# Altium schematic sheet PERIPHERAL.SchDoc
size A4; SheetNumber: 4; SheetTotal: 5
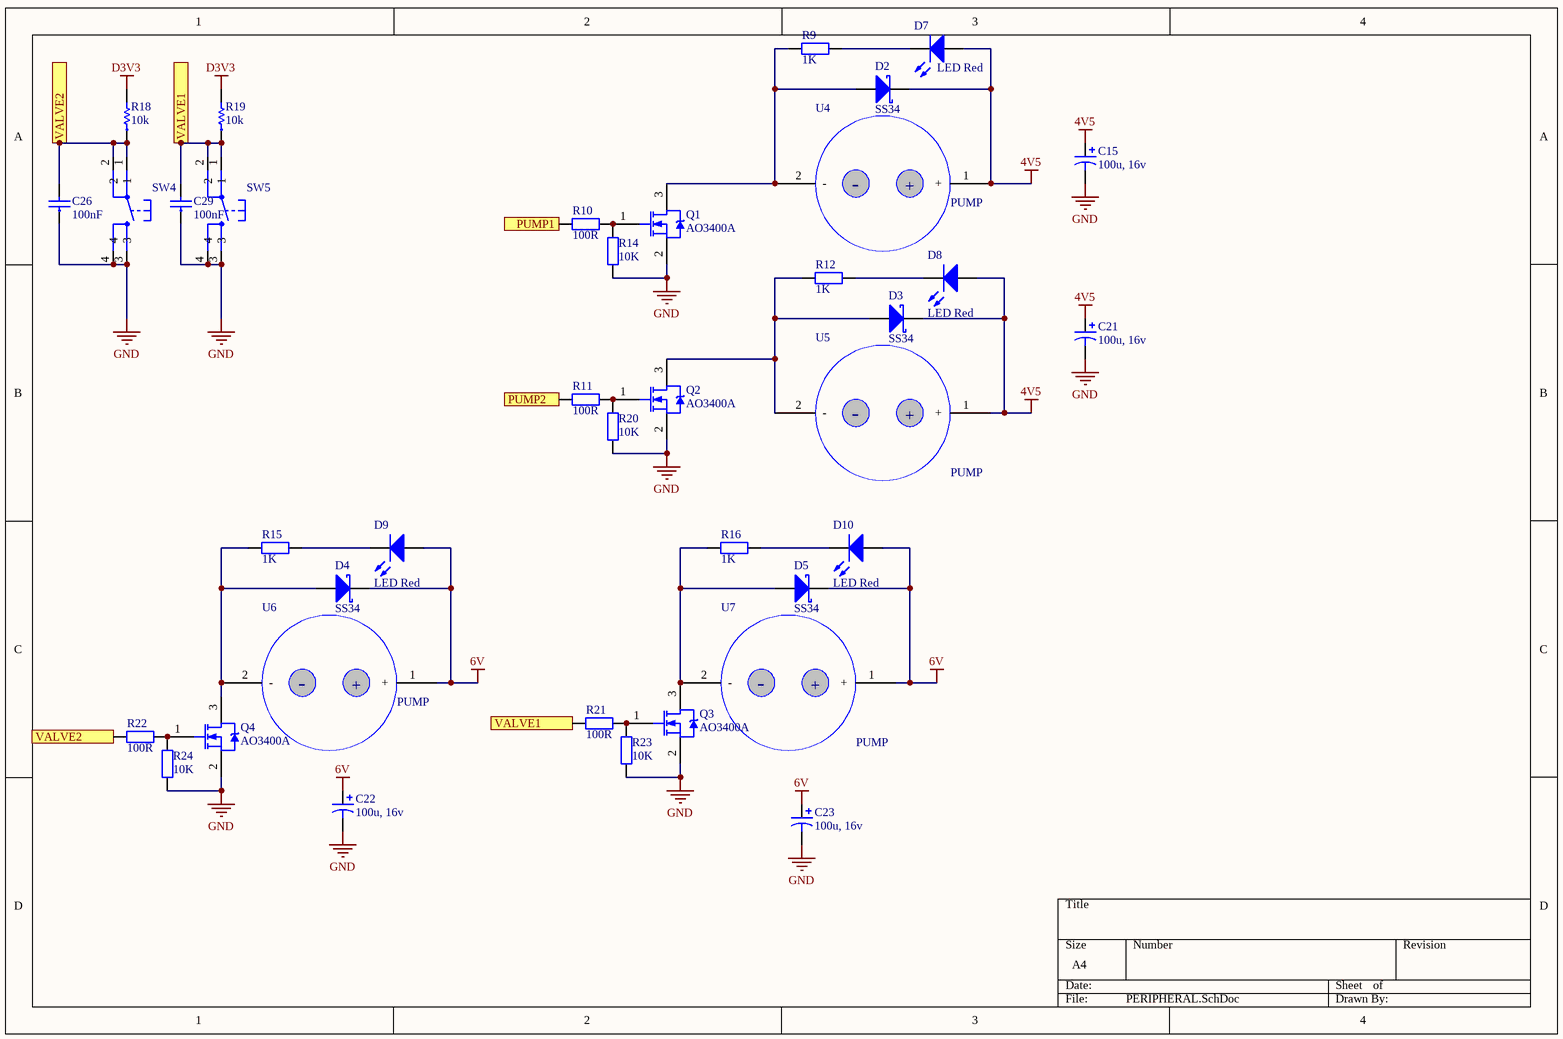
[diagram p0: PERIPHERAL.SchDoc]

## Parts
C15  value 100u, 16v  [CAPACITOR SIZE_D(D6.6)]  (hidden comment: CAP ALUM 100UF 20% 16V SMD)
C21  value 100u, 16v  [CAPACITOR SIZE_D(D6.6)]  (hidden comment: CAP ALUM 100UF 20% 16V SMD)
C22  value 100u, 16v  [CAPACITOR SIZE_D(D6.6)]  (hidden comment: CAP ALUM 100UF 20% 16V SMD)
C23  value 100u, 16v  [CAPACITOR SIZE_D(D6.6)]  (hidden comment: CAP ALUM 100UF 20% 16V SMD)
C26  100nF  [C0603]
C29  100nF  [C0603]
D2  SS34  [DO-214AC]
D3  SS34  [DO-214AC]
D4  SS34  [DO-214AC]
D5  SS34  [DO-214AC]
D7  LED Red  [LED0603-R]
D8  LED Red  [LED0603-R]
D9  LED Red  [LED0603-R]
D10  LED Red  [LED0603-R]
Q1  AO3400A  [SOT-23]
Q2  AO3400A  [SOT-23]
Q3  AO3400A  [SOT-23]
Q4  AO3400A  [SOT-23]
R9  value 1K  [R0603]  (hidden comment: RES 1K 5% 1/10W 0603)
R10  value 100R  [R0603]  (hidden comment: RES 100R 5% 1/10W 0603)
R11  value 100R  [R0603]  (hidden comment: RES 100R 5% 1/10W 0603)
R12  value 1K  [R0603]  (hidden comment: RES 1K 5% 1/10W 0603)
R14  value 10K  [R0603]  (hidden comment: RES 10K 5% 1/10W 0603)
R15  value 1K  [R0603]  (hidden comment: RES 1K 5% 1/10W 0603)
R16  value 1K  [R0603]  (hidden comment: RES 1K 5% 1/10W 0603)
R18  10k  [R0603]
R19  10k  [R0603]
R20  value 10K  [R0603]  (hidden comment: RES 10K 5% 1/10W 0603)
R21  value 100R  [R0603]  (hidden comment: RES 100R 5% 1/10W 0603)
R22  value 100R  [R0603]  (hidden comment: RES 100R 5% 1/10W 0603)
R23  value 10K  [R0603]  (hidden comment: RES 10K 5% 1/10W 0603)
R24  value 10K  [R0603]  (hidden comment: RES 10K 5% 1/10W 0603)
SW4  SW2  [SWITCH]  (value not drawn)
SW5  SW2  [SWITCH]  (value not drawn)
U4  PUMP  [Pump]
U5  PUMP  [Pump]
U6  PUMP  [VALVE]
U7  PUMP  [VALVE]

## Ports
PUMP1 (in), PUMP2 (in), VALVE1 (in), VALVE2 (in)

## Nets
4V5: C15.1 C21.1 D2.2(K) D3.2(K) D7.1(A) D8.1(A) U4.1(+) U5.1(+)
6V: C22.1 C23.1 D4.2(K) D5.2(K) D9.1(A) D10.1(A) U6.1(+) U7.1(+)
D3V3: R18.2 R19.2
GND: C15.2 C21.2 C22.2 C23.2 C26.1 C29.1 Q1.2(S) Q2.2(S) Q3.2(S) Q4.2(S) R14.1 R20.1 R23.1 R24.1 SW4.3 SW4.4 SW5.3 SW5.4
PUMP1: R10.1 ; port PUMP1
PUMP2: R11.1 ; port PUMP2
VALVE1: C29.2 R19.1 R21.1 SW5.1 SW5.2 ; port VALVE1
VALVE2: C26.2 R18.1 R22.1 SW4.1 SW4.2 ; port VALVE2
NetD2_1: D2.1(A) Q1.3(D) R9.1 U4.2(-)
NetD3_1: D3.1(A) Q2.3(D) R12.1 U5.2(-)
NetD4_1: D4.1(A) Q4.3(D) R15.1 U6.2(-)
NetD5_1: D5.1(A) Q3.3(D) R16.1 U7.2(-)
NetD7_2: D7.2(K) R9.2
NetD8_2: D8.2(K) R12.2
NetD9_2: D9.2(K) R15.2
NetD10_2: D10.2(K) R16.2
NetQ1_1: Q1.1(G) R10.2 R14.2
NetQ2_1: Q2.1(G) R11.2 R20.2
NetQ3_1: Q3.1(G) R21.2 R23.2
NetQ4_1: Q4.1(G) R22.2 R24.2

## Library data of the parts
C15 C21-C23 = UWT1C101MCL1GB: Supplier 1: Digi-Key; Supplier Part Number 1: 493-2177-2-ND
C26 C29 = CAPCER0001 100nF 10% 50V X7R 0603 SMD: CAP CER 100nF 10% 50V X7R 0603 SMD; LINE: SMT; TYPE: EP; UNIT: PCS; TMG CODE: None; CERTIFICATION: NA; CLASS: B; MOUNT: SMD; TMG PN: CAPCER0001; ComponentLink1Description: Datasheet; ComponentLink1URL: https://datasheet.lcsc.com/lcsc/1811021431_Samsung-Electro-Mechanics-CL10B104KB8NNNC_C1591.pdf; Footprint: 0603
D2-D5 = SS34: Schottky Diode 40V 3A SMA; Supplier 1: Digi-Key; Supplier Part Number 1: SS34-E3/57TGICT-ND; Value: SS34
D7-D10 = LTST-C190KRKT: Lite-On LED Red 0603; Supplier Part Number 1: 160-1436-1-ND; Supplier 1: Digi-Key; Supplier Part Number 2: FL1413; Value: LED Red
Q1-Q4 = IRFML8244TRPBF: MOSFET N-CH 25V 5.8A SOT23; Supplier 1: Digi-Key; Supplier Part Number 1: IRFML8244TRPBFCT-ND; Value: AO3400A
R9 R12 R15 R16 = RC0603JR-071KL: Yageo RES 1K 5% 1/10W 0603; Supplier 1: LCSC; Supplier Part Number 1: C131707
R10 R11 R21 R22 = RC0603JR-07100RL: Yageo RES 100R 5% 1/10W 0603; Supplier 1: Digi-Key; Supplier Part Number 1: 311-100GRCT-ND; Supplier Part Number 2: FL2438
R14 R20 R23 R24 = RC0603JR-0710KL: Yageo RES 10K 5% 1/10W 0603; Supplier 1: Digi-Key; Supplier Part Number 1: 311-10KGRCT-ND; Supplier Part Number 2: FL2403
R18 R19 = RESCHP0428 8K4 1% 0603 SMD: RES CHP 8K4 1% 1/10W 0603 SMD; LINE: SMT; UNIT: PCS; TMG CODE: None; CERTIFICATION: NA; CLASS: B; MOUNT: SMD; TYPE: EP; ComponentLink1Description: Datasheet; ComponentLink1URL: https://datasheet.lcsc.com/lcsc/2304140030_YAGEO-RT0603FRD07100RL_C160603.pdf
SW4 SW5 = SW2: Switch button 4 pin
U4-U7 = A5F083: Connector Header 2 Position 6.35mm Solder Straight Thru-Hole 2 Terminal 1 Port MLX-Series; Manufacturer: Molex; Manufacturer Lifecycle Status: ACTIVE; Connector Type: Power; Contact Resistance: 3.5mΩ; Current Rating: 13.5A; Dielectric Material: Polyester; Gender: Female; Glow Wire Compliant: Non-compliant; Insulation Resistance: 1GΩ; Number of Circuits: 2; Operating Force: 6.672N; Plating: Tin; Plating Thickness: 3.5052µm; Voltage Rating: 600V; Supplier 1: Arrow Electronics; Manufacturer Part Number: 10-84-4022; RoHS: Compliant; Category: Headers and Wire Housings; Stock 1: 4724; Pricing 1: 1=0,2907, 10=0,267, 100=0,245, 500=0,229, 1836=0,216 (USD); China RoHS: Compliant; Color: Natural; Contact Gender: Female; Contact Material: Bronze; Contact Plating: Tin; Country of Origin: US; Flammability Rating: UL94 V-2; Halogen Free: Low Halogen; Housing Material: Nylon; Lead Free: Lead Free; Lifecycle Status: Production; Max Operating Temperature: 105°C; Min Operating Temperature: -55°C; Mount: Through Hole; Number of Contacts: 2; Number of Pins: 2; Number of Positions: 2; Number of Rows: 1; Orientation: Vertical; Packaging: Carton; Pitch: 6.35mm; Radiation Hardening: No; REACH SVHC: Yes; Schedule B: 8536694040, 8536694040|8536694040|8536694040|8536694040|8536694040; Shell Material: POLYAMIDE66; Terminal Pitch: 6.35mm; Termination: Solder; ComponentLink1URL: https://datasheet.octopart.com:443/10-84-4022-Molex-datasheet-137053637.pdf?src-supplier=element14+APAC; ComponentLink1Description: https://datasheet.octopart.com:443/10-84-4022-Molex-datasheet-137053637.pdf?src-supplier=element14+APAC; ComponentLink2URL: https://datasheet.octopart.com:443/10-84-4022-Molex-datasheet-13791970.pdf?src-supplier=Molex; ComponentLink2Description: https://datasheet.octopart.com:443/10-84-4022-Molex-datasheet-13791970.pdf?src-supplier=Molex; ComponentLink3URL: https://sigma.octopart.com:443/16272272/technical_drawing/Molex-10-84-4022.pdf?src-supplier=Molex; ComponentLink3Description: https://sigma.octopart.com:443/16272272/technical_drawing/Molex-10-84-4022.pdf?src-supplier=Molex; ComponentLink4URL: https://datasheet.octopart.com:443/010844022-Molex-datasheet-5390850.pdf?src-supplier=Molex; ComponentLink4Description: https://datasheet.octopart.com:443/010844022-Molex-datasheet-5390850.pdf?src-supplier=Molex; ComponentLink5URL: https://datasheet.octopart.com:443/10-84-4022-Molex-datasheet-154742841.pdf?src-supplier=Master+Electronics; ComponentLink5Description: https://datasheet.octopart.com:443/10-84-4022-Molex-datasheet-154742841.pdf?src-supplier=Master+Electronics; ComponentLink6URL: https://datasheet.octopart.com:443/10-84-4022-Molex-datasheet-33343972.pdf?src-supplier=Electro+Sonic; ComponentLink6Description: https://datasheet.octopart.com:443/10-84-4022-Molex-datasheet-33343972.pdf?src-supplier=Electro+Sonic; ComponentLink7URL: https://datasheet.octopart.com:443/10-84-4022-Molex-datasheet-21205596.pdf?src-supplier=Electro+Sonic; ComponentLink7Description: https://datasheet.octopart.com:443/10-84-4022-Molex-datasheet-21205596.pdf?src-supplier=Electro+Sonic; ComponentLink8URL: https://datasheet.octopart.com:443/10-84-4022-Molex-datasheet-62102692.pdf?src-supplier=Electro+Sonic; ComponentLink8Description: https://datasheet.octopart.com:443/10-84-4022-Molex-datasheet-62102692.pdf?src-supplier=Electro+Sonic; ComponentLink9URL: https://datasheet.octopart.com:443/10-84-4022-Molex-datasheet-140174504.pdf?src-supplier=RS+(Formerly+Allied+Electronics); ComponentLink9Description: https://datasheet.octopart.com:443/10-84-4022-Molex-datasheet-140174504.pdf?src-supplier=RS+(Formerly+Allied+Electronics); ComponentLink10URL: https://datasheet.octopart.com:443/10-84-4022-Molex-datasheet-120134962.pdf?src-supplier=RS+(Formerly+Allied+Electronics); ComponentLink10Description: https://datasheet.octopart.com:443/10-84-4022-Molex-datasheet-120134962.pdf?src-supplier=RS+(Formerly+Allied+Electronics); ComponentLink11URL: https://datasheet.octopart.com:443/10-84-4022-Molex-datasheet-32867450.pdf?src-supplier=Newark; ComponentLink11Description: https://datasheet.octopart.com:443/10-84-4022-Molex-datasheet-32867450.pdf?src-supplier=Newark; ComponentLink12URL: https://datasheet.octopart.com:443/10844022-Molex-datasheet-8320017.pdf?src-supplier=Jameco; ComponentLink12Description: https://datasheet.octopart.com:443/10844022-Molex-datasheet-8320017.pdf?src-supplier=Jameco; ComponentLink13URL: https://datasheet.octopart.com:443/10-84-4022-Molex-datasheet-5314522.pdf?src-supplier=Verical; ComponentLink13Description: https://datasheet.octopart.com:443/10-84-4022-Molex-datasheet-5314522.pdf?src-supplier=Verical; ComponentLink14URL: https://datasheet.octopart.com:443/10-84-4022-Molex-datasheet-27226.pdf?src-supplier=DigiKey; ComponentLink14Description: https://datasheet.octopart.com:443/10-84-4022-Molex-datasheet-27226.pdf?src-supplier=DigiKey; ComponentLink15URL: http://sigma.octopart.com:80/16272275/rohs_statement/Molex-10-84-4022.pdf?src-supplier=Compliance+Statements; ComponentLink15Description: http://sigma.octopart.com:80/16272275/rohs_statement/Molex-10-84-4022.pdf?src-supplier=Compliance+Statements; ComponentLink16URL: http://sigma.octopart.com:80/reach_statement/Molex-company-74.pdf?src-supplier=Compliance+Statements; ComponentLink16Description: http://sigma.octopart.com:80/reach_statement/Molex-company-74.pdf?src-supplier=Compliance+Statements; ComponentLink17URL: http://sigma.octopart.com:80/rohs_statement/Molex-company-73.pdf?src-supplier=Compliance+Statements; ComponentLink17Description: http://sigma.octopart.com:80/rohs_statement/Molex-company-73.pdf?src-supplier=Compliance+Statements; ComponentLink18URL: http://sigma.octopart.com:80/conflict_mineral_statement/Molex-company-72.pdf?src-supplier=Compliance+Statements; ComponentLink18Description: http://sigma.octopart.com:80/conflict_mineral_statement/Molex-company-72.pdf?src-supplier=Compliance+Statements; Supplier Part Number 1: 0010844022